# EAGLE schematic TraceurDessinateur_ControleCNC (EAGLE 9.6.2)

## Sheet 1 of 2
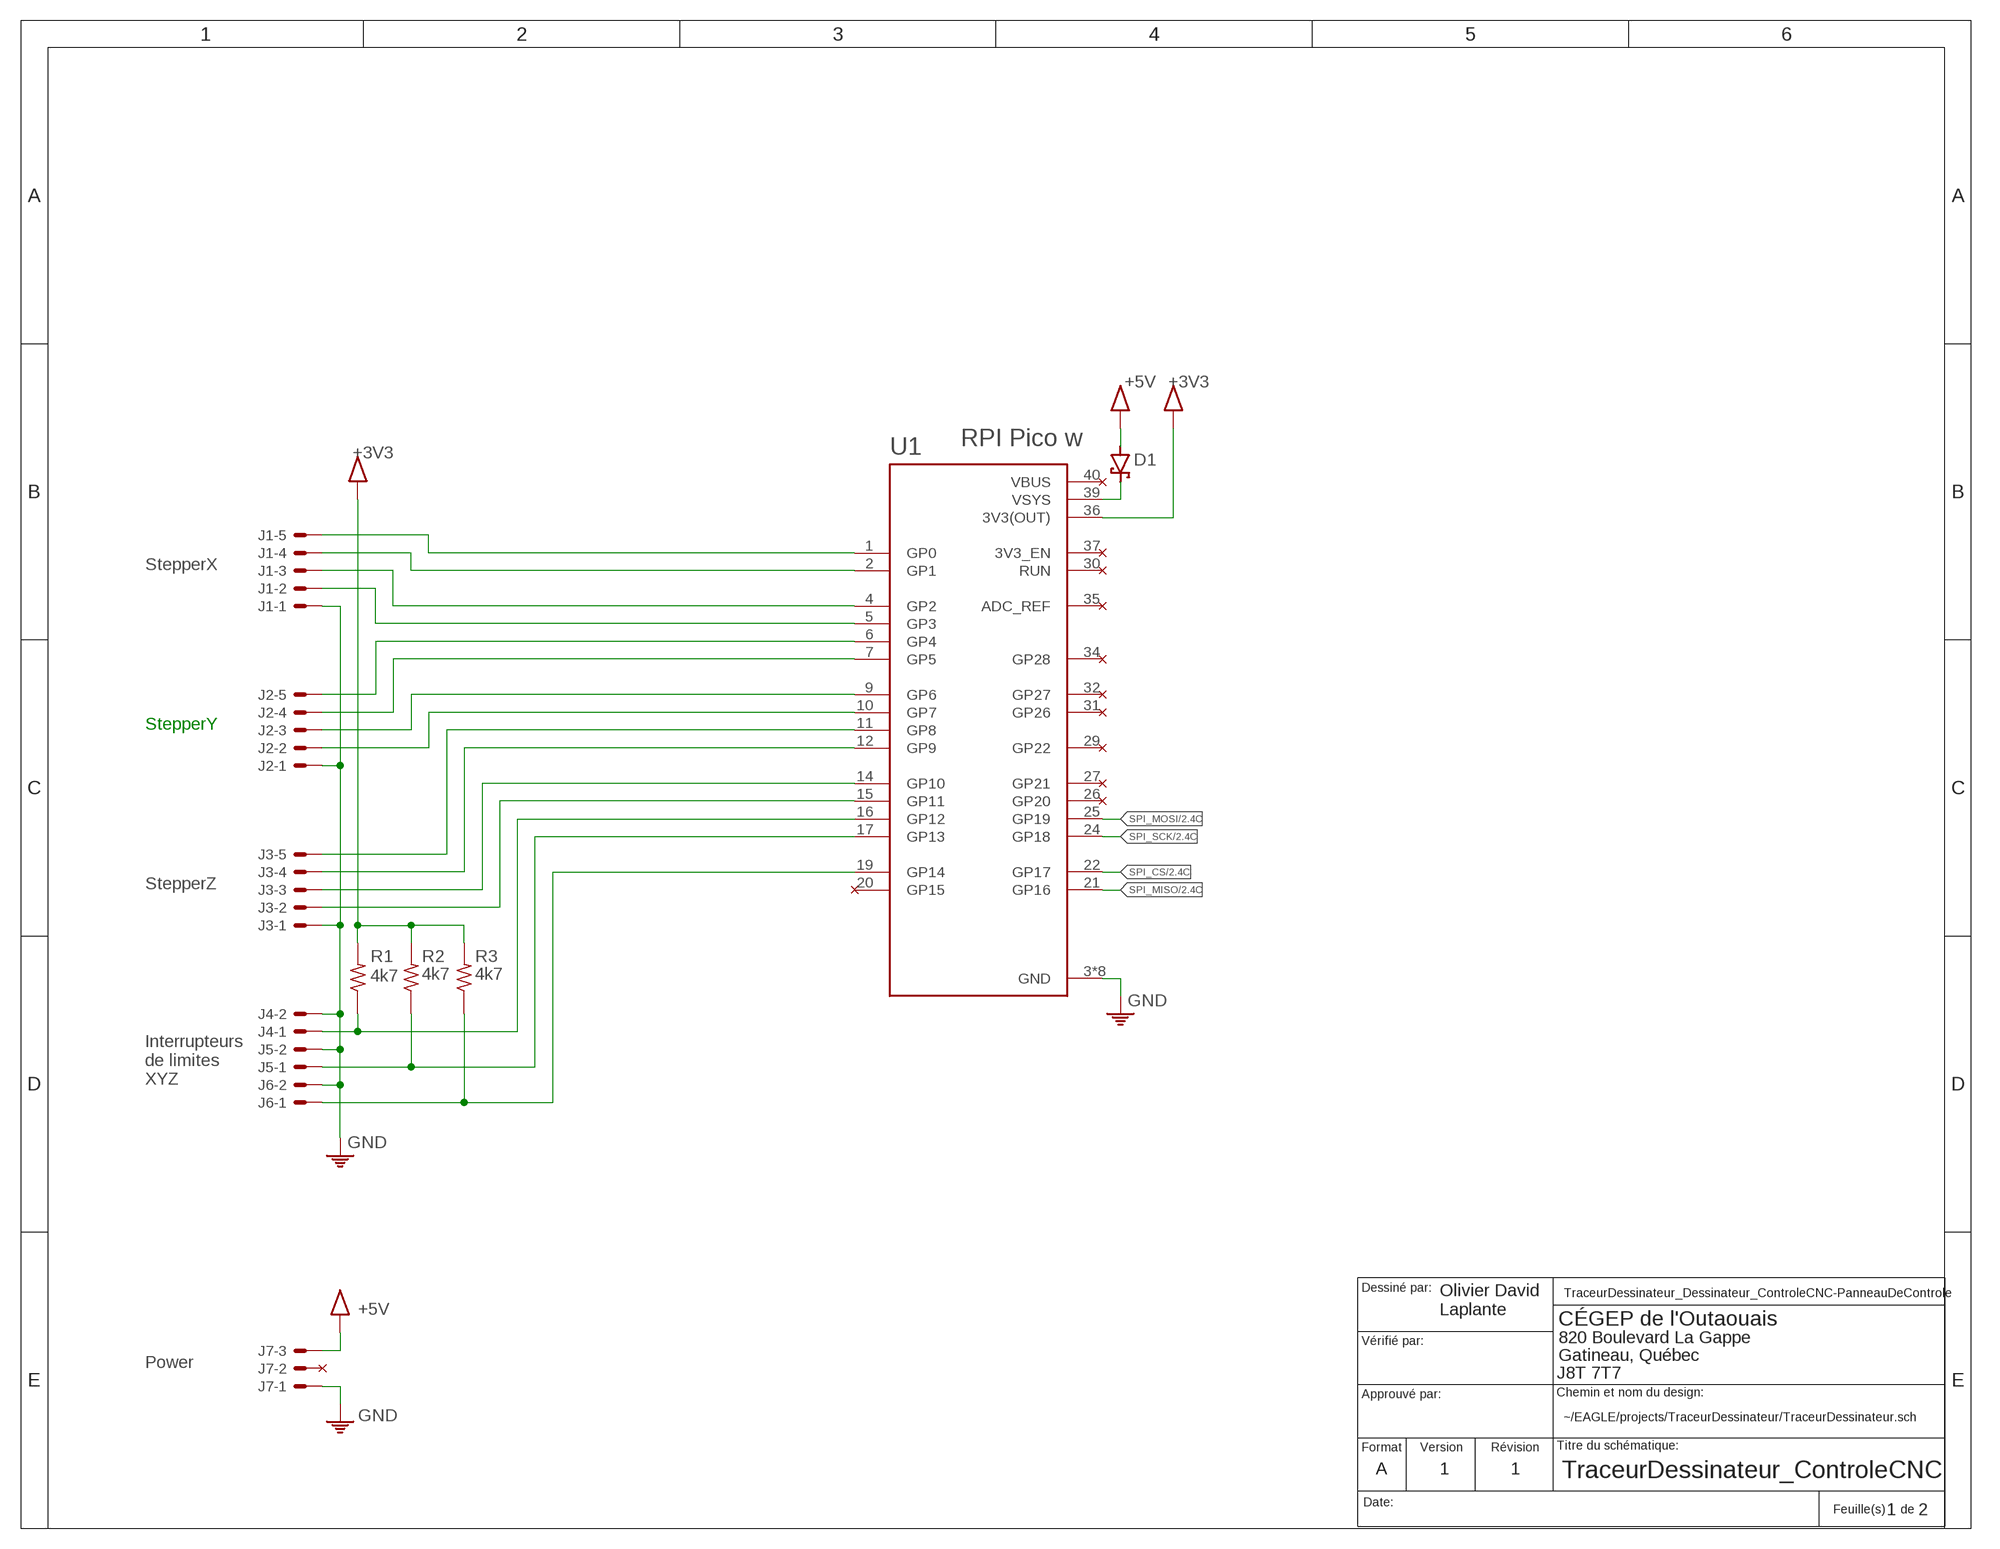
[diagram p0: schematic, sheet 1]

### Parts
D1  1N5817-B  [DO41-7.6]
J1  22-23-2051  [22-23-2051]
J2  22-23-2051  [22-23-2051]
J3  22-23-2051  [22-23-2051]
J4  22-23-2021  [22-23-2021]
J5  22-23-2021  [22-23-2021]
J6  22-23-2021  [22-23-2021]
J7  22-23-2031  [22-23-2031]
R1  4k7  RR1206  [R1206]
R2  4k7  RR1206  [R1206]
R3  4k7  RR1206  [R1206]
U1  RASPBERRY_PICO-HEADERS-NO_DEBUGPICO-PKG-TH-NO_DEBUG  [PICO-PKG-TH-NO_DEBUG]
U$1  NC  (no package)
U$3  NC  (no package)
U$4  NC  (no package)
U$5  NC  (no package)
U$6  NC  (no package)
U$16  NC  (no package)
U$17  NC  (no package)
U$18  NC  (no package)
U$19  NC  (no package)
U$20  NC  (no package)
U$21  NC  (no package)
U$22  NC  (no package)

### Nets
+3V3: R1.2 R2.2 R3.2 U1.36(3V3(OUT)) ; also sheet 2
+5V: D1.A J7.3 ; also sheet 2
GND: J1.1 J2.1 J3.1 J4.2 J5.2 J6.2 J7.1 U1.3(GND) U1.8(GND) U1.13(GND) U1.18(GND) U1.23(GND) U1.28(GND) U1.33(GND) U1.38(GND) ; also sheet 2
N$1: J1.5 U1.1(GP0)
N$2: J1.4 U1.2(GP1)
N$3: J1.3 U1.4(GP2)
N$4: J1.2 U1.5(GP3)
N$5: J2.5 U1.6(GP4)
N$6: J2.4 U1.7(GP5)
N$7: J2.3 U1.9(GP6)
N$8: J2.2 U1.10(GP7)
N$9: J3.5 U1.11(GP8)
N$10: J3.4 U1.12(GP9)
N$11: J3.3 U1.14(GP10)
N$12: J3.2 U1.15(GP11)
N$13: J4.1 R1.1 U1.16(GP12)
N$14: J5.1 R2.1 U1.17(GP13)
N$15: J6.1 R3.1 U1.19(GP14)
N$16: U1.40(VBUS) U$1.P$1
N$17: D1.C U1.39(VSYS)
N$19: U1.37(3V3_EN) U$3.P$1
N$20: U1.30(RUN) U$4.P$1
N$21: U1.35(ADC_REF) U$5.P$1
N$22: J7.2 U$6.P$1
N$53: U1.20(GP15) U$16.P$1
N$54: U1.26(GP20) U$17.P$1
N$55: U1.27(GP21) U$18.P$1
N$56: U1.29(GP22) U$19.P$1
N$57: U1.31(GP26) U$20.P$1
N$58: U1.32(GP27) U$21.P$1
N$59: U1.34(GP28) U$22.P$1
SPI_CS: U1.22(GP17) ; also sheet 2
SPI_MISO: U1.21(GP16) ; also sheet 2
SPI_MOSI: U1.25(GP19) ; also sheet 2
SPI_SCK: U1.24(GP18) ; also sheet 2

### Notes on the sheet
- RPI Pico w
- StepperX
- StepperY
- StepperZ
- Interrupteurs
  de limites
  XYZ
- TraceurDessinateur_Dessinateur_ControleCNC-PanneauDeControle
- Olivier David
  Laplante
- Power
- ~/EAGLE/projects/TraceurDessinateur/TraceurDessinateur.sch
- A | 1 | 1
- 1 | 2

## Sheet 2 of 2
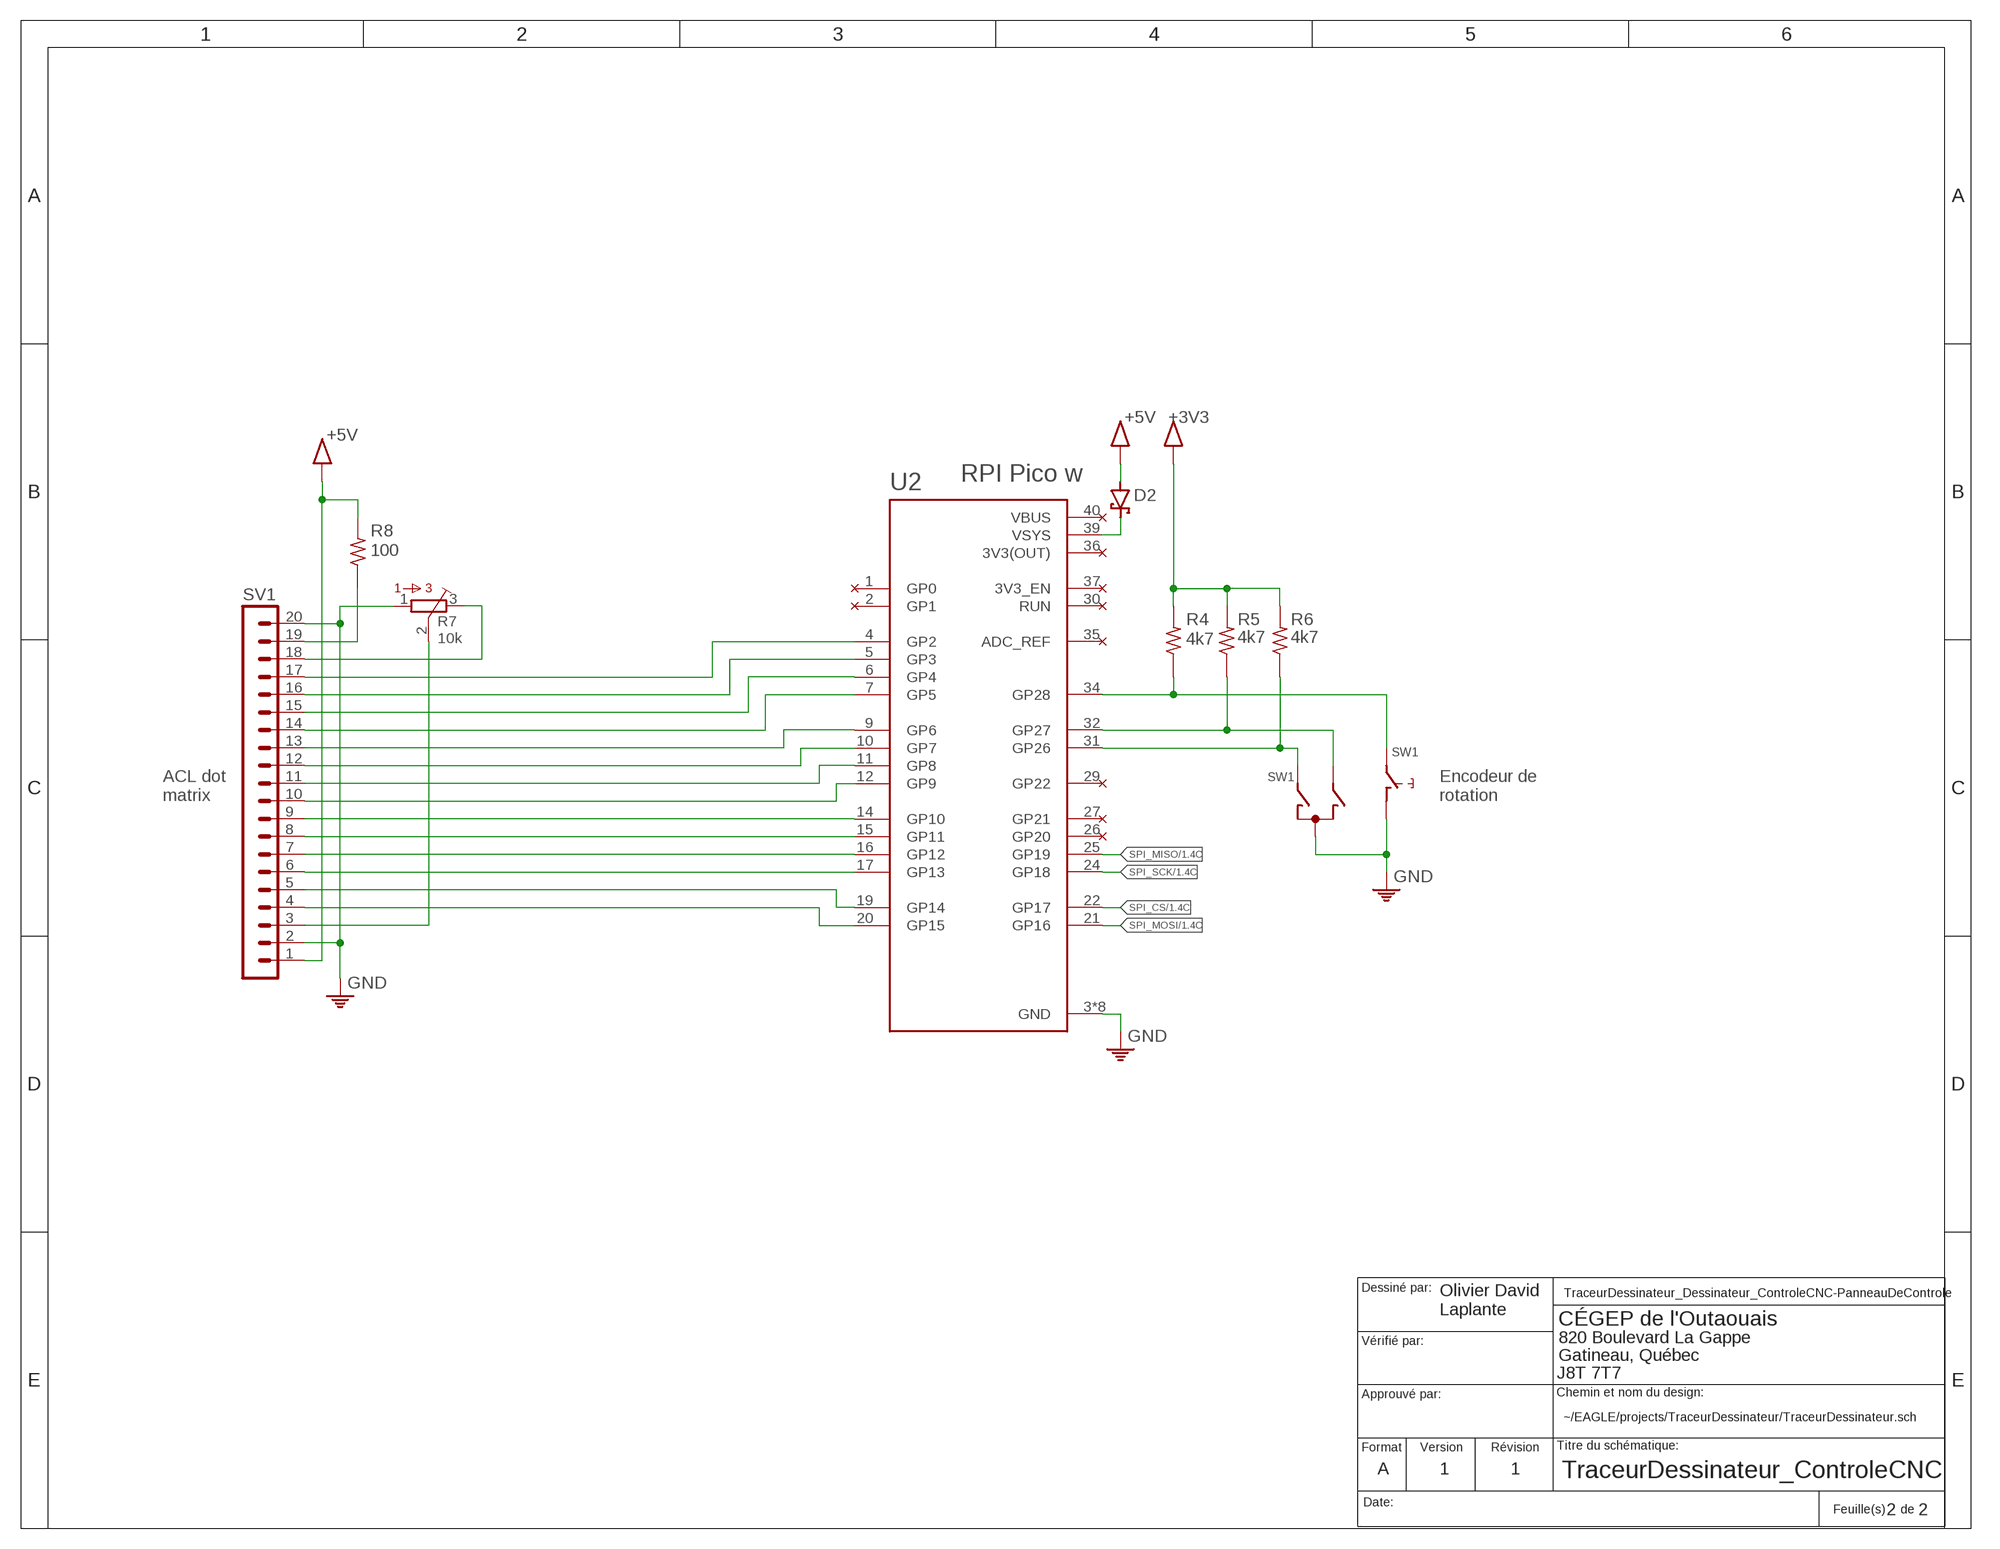
[diagram p1: schematic, sheet 2]

### Parts
D2  1N5817-B  [DO41-7.6]
R4  4k7  RR1206  [R1206]
R5  4k7  RR1206  [R1206]
R6  4k7  RR1206  [R1206]
R7  10k  3362P  [3362P]
R8  100  RR1206  [R1206]
SV1  MA20-1  [MA20-1]
SW1  EC12E_SW  [ALPS_EC12E_SW]
U2  RASPBERRY_PICO-HEADERS-NO_DEBUGPICO-PKG-TH-NO_DEBUG  [PICO-PKG-TH-NO_DEBUG]
U$2  NC  (no package)
U$7  NC  (no package)
U$8  NC  (no package)
U$9  NC  (no package)
U$10  NC  (no package)
U$11  NC  (no package)
U$12  NC  (no package)
U$13  NC  (no package)
U$14  NC  (no package)
U$15  NC  (no package)

### Nets
+3V3: R4.2 R5.2 R6.2 ; also sheet 1
+5V: D2.A R8.2 SV1.1 ; also sheet 1
GND: U2.3(GND) U2.8(GND) U2.13(GND) U2.18(GND) U2.23(GND) U2.28(GND) U2.33(GND) U2.38(GND) ; also sheet 1
N$18: SV1.4 U2.20(GP15)
N$23: D2.C U2.39(VSYS)
N$24: U2.40(VBUS) U$7.P$1
N$25: U2.36(3V3(OUT)) U$8.P$1
N$26: U2.37(3V3_EN) U$9.P$1
N$27: U2.30(RUN) U$10.P$1
N$28: U2.35(ADC_REF) U$11.P$1
N$29: R6.1 SW1.A U2.31(GP26)
N$30: R5.1 SW1.B U2.32(GP27)
N$31: R4.1 SW1.E U2.34(GP28)
N$32: SV1.5 U2.19(GP14)
N$33: SV1.6 U2.17(GP13)
N$34: SV1.7 U2.16(GP12)
N$35: SV1.8 U2.15(GP11)
N$36: SV1.9 U2.14(GP10)
N$37: SV1.10 U2.12(GP9)
N$38: SV1.11 U2.11(GP8)
N$39: SV1.12 U2.10(GP7)
N$40: SV1.13 U2.9(GP6)
N$41: SV1.14 U2.7(GP5)
N$42: SV1.15 U2.6(GP4)
N$43: SV1.16 U2.5(GP3)
N$44: SV1.17 U2.4(GP2)
N$45: R7.3 SV1.18
N$46: R7.2 SV1.3
N$47: R8.1 SV1.19
N$48: U2.26(GP20) U$2.P$1
N$49: U2.27(GP21) U$12.P$1
N$50: U2.29(GP22) U$13.P$1
N$51: U2.2(GP1) U$14.P$1
N$52: U2.1(GP0) U$15.P$1
PE: R7.1 SV1.2 SV1.20 SW1.C SW1.D ; supply symbol labelled GND
SPI_CS: U2.22(GP17) ; also sheet 1
SPI_MISO: U2.25(GP19) ; also sheet 1
SPI_MOSI: U2.21(GP16) ; also sheet 1
SPI_SCK: U2.24(GP18) ; also sheet 1
Unconnected: SW1.GND1(G) SW1.GND2(G)

### Notes on the sheet
- RPI Pico w
- ACL dot
  matrix
- Encodeur de 
  rotation
- TraceurDessinateur_Dessinateur_ControleCNC-PanneauDeControle
- Olivier David
  Laplante
- ~/EAGLE/projects/TraceurDessinateur/TraceurDessinateur.sch
- A | 1 | 1
- 2 | 2

## Library data of the parts
D1 D2 = diode:1N581*: 1.0A SCHOTTKY BARRIER RECTIFIER Source: http://www.diodes.com/datasheets/ds23001.pdf
J1-J3 = con-molex:22-23-2051: .100" (2.54mm) Center Header - 5 Pin; MF: MOLEX; MPN: 22-23-2051; OC_FARNELL: 1462952; OC_NEWARK: 38C9178
J4-J6 = con-molex:22-23-2021: .100" (2.54mm) Center Header - 2 Pin; MF: MOLEX; MPN: 22-23-2021; OC_FARNELL: 1462926; OC_NEWARK: 25C3832
J7 = con-molex:22-23-2031: .100" (2.54mm) Center Header - 3 Pin; MF: MOLEX; MPN: 22-23-2031; OC_FARNELL: 1462950; OC_NEWARK: 30C0862
R1-R6 R8 = 1_TGE:R: R
R7 = bourns:3362: 3362 Series 1/4" Square Trimmer
SV1 = con-lstb:MA20-1: PIN HEADER; OC_FARNELL: unknown; OC_NEWARK: unknown
SW1 = switch-alps:EC12E_SW: ALPS rotary Encoder EC12E series with switch; MPN: EC12E2424407; OC_FARNELL: 1520813; OC_NEWARK: 74M1068
U1 U2 = RpiPico:RASPBERRY_PICO-HEADERS-NO_DEBUG
U$1-U$22 = 1_Personnal:NC